# Altium schematic sheet Indicators.SchDoc
size A4; SheetNumber: 7; SheetTotal: 7
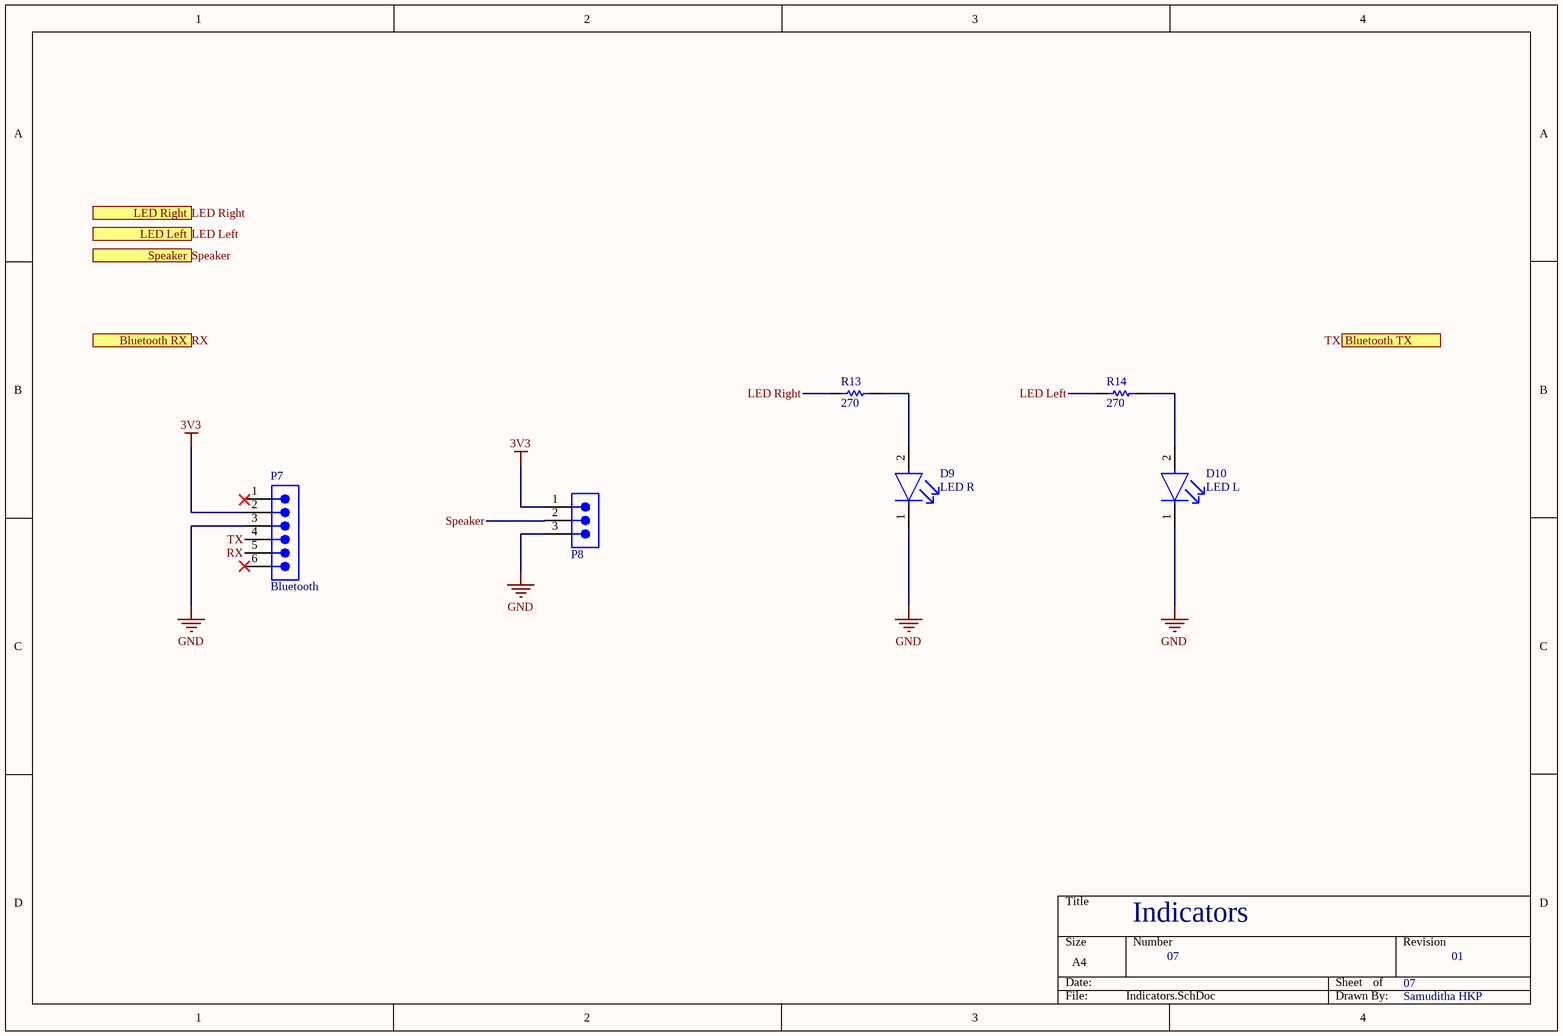
[diagram p0: Indicators.SchDoc]

## Parts
D9  LED R  [FP-APHHS1005CGCK-MFG]
D10  LED L  [FP-APHHS1005CGCK-MFG]
P7  Bluetooth  [61300611121]
P8  61300311021  [61300311021]  (value not drawn)
R13  270  [RESC1005X40X25ML05T05]
R14  270  [RESC1005X40X25ML05T05]

## Ports
Bluetooth RX (in, see Main[1C], MCU[4C]), Bluetooth TX (out, see Main[2C], MCU[1C]), LED Left (in, see Main[1C], MCU[4C]), LED Right (in, see Main[1C], MCU[4C]), Speaker (in, see Main[1C], MCU[4C])

## Nets
3V3: P7.2 P8.1
GND: D9.1(C) D10.1(C) P7.3 P8.3
LED Left: R14.2 ; port LED Left
LED Right: R13.2 ; port LED Right
RX: P7.5 ; port Bluetooth RX
Speaker: P8.2 ; port Speaker
TX: P7.4 ; port Bluetooth TX
NetD9_2: D9.2(A) R13.1
NetD10_2: D10.2(A) R14.1

Not connected (* = marked no-connect by the designer): P7 1 6*

## Notes on the sheet
- Indicators
- 07
- 01
- Samuditha HKP

## Library data of the parts
D9 D10 = CMP-44529-000044-1: LED GREEN CLEAR CHIP SMD; Viewing Angle: 120°; Dominant Wavelength: 570nm; Test Current: 20mA; Luminous Intensity: 50mcd; Forward Voltage: 2.1V; Number of LEDs: 1; Lens Color: Clear; Packaging: Tape and Reel; Max Operating Temperature: 85°C; Illumination Color: Green; Length: 1mm; Mount: Surface Mount; Lens Style: Clear; Color: Green; Number of Pins: 2; Wavelength: 570nm; Case/Package: 0402; Width: 0.5mm; Package Quantity: 2000; Case Code (Metric): 1005; Height: 0.6mm; Lead Free: Lead Free; Case Code (Imperial): 0402; Forward Current: 20mA; Min Operating Temperature: -40°C
P7 = CMP-1502-01070-3: NexarPartId: 20084590; Current Rating: 3A; Pitch: 2.54mm; Gender: Male; Operating Supply Voltage: 250V; Connector Type: Male Pin; Number of Positions: 6; Contact Resistance: 20mΩ; Packaging: Bulk; Number of Pins: 6; Number of Rows: 1; Contact Plating: Gold; Lead Free: Lead Free; RoHS: Compliant; Contact Mating Length: 5.9944mm; Voltage Rating: 250V; REACH SVHC: Unknown; Contact Gender: Male; Housing Material: PBT; Min Operating Temperature: -40°C; Lead Pitch: 2.54mm; Mount: Through Hole; Number of Contacts: 6; Max Operating Temperature: 105°C; Contact Material: Copper; Orientation: Vertical; Termination: Through Hole; Color: Black; Height: 8.89mm
P8 = CMP-1502-01061-3: NexarPartId: 32855520; Contact Resistance: 20mΩ; Number of Positions: 3; Current Rating: 3A; Gender: Male; Operating Supply Voltage: 250V; Connector Type: Male Pin; Pitch: 2.54mm; Number of Rows: 1; Lead Pitch: 2.54mm; REACH SVHC: Unknown; Packaging: Bulk; Mount: Through Hole; Number of Pins: 3; Color: Black; Contact Plating: Gold; Contact Material: Copper; Number of Contacts: 3; Contact Mating Length: 5.9944mm; Termination: Solder; RoHS: Compliant
R13 R14 = CMP-2002-08427-1: Part Number: CRCW0402270RFKED; Manufacturer: Vishay Dale